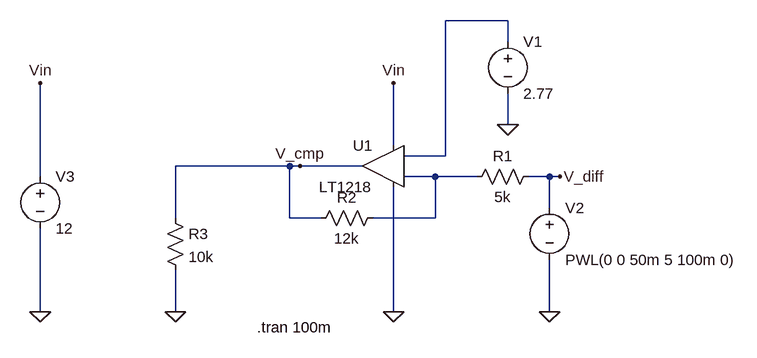
[diagram p0: schematic PositiveSchmitt.asc]
PositiveSchmitt.asc, the LTspice schematic file:
Version 4
SHEET 1 880 680
WIRE 256 -336 160 -336
WIRE 256 -304 256 -336
WIRE 256 -176 256 -224
WIRE 80 -144 80 -240
WIRE 160 -128 160 -336
WIRE 160 -128 96 -128
WIRE -80 -112 -256 -112
WIRE -64 -112 -80 -112
WIRE 32 -112 -64 -112
WIRE -464 -96 -464 -240
WIRE 144 -96 96 -96
WIRE 208 -96 144 -96
WIRE 320 -96 288 -96
WIRE 336 -96 320 -96
WIRE 320 -48 320 -96
WIRE -256 -32 -256 -112
WIRE -80 -32 -80 -112
WIRE -32 -32 -80 -32
WIRE 144 -32 144 -96
WIRE 144 -32 48 -32
WIRE -464 112 -464 -16
WIRE -256 112 -256 48
WIRE 80 112 80 -80
WIRE 320 112 320 32
FLAG 336 -96 V_diff
FLAG 256 -176 0
FLAG 80 112 0
FLAG 80 -240 Vin
FLAG -64 -112 V_cmp
FLAG 320 112 0
FLAG -256 112 0
FLAG -464 112 0
FLAG -464 -240 Vin
SYMBOL res 304 -112 R90
WINDOW 0 0 56 VBottom 2
WINDOW 3 32 56 VTop 2
SYMATTR InstName R1
SYMATTR Value 5k
SYMBOL res 64 -48 R90
WINDOW 0 0 56 VBottom 2
WINDOW 3 32 56 VTop 2
SYMATTR InstName R2
SYMATTR Value 12k
SYMBOL voltage 256 -320 R0
SYMATTR InstName V1
SYMATTR Value 2.77
SYMBOL voltage 320 -64 R0
WINDOW 123 0 0 Left 2
WINDOW 39 0 0 Left 2
SYMATTR InstName V2
SYMATTR Value PWL(0 0 50m 5 100m 0)
SYMBOL res -272 -48 R0
SYMATTR InstName R3
SYMATTR Value 10k
SYMBOL voltage -464 -112 R0
SYMATTR InstName V3
SYMATTR Value 12
SYMBOL Opamps\\LT1218 64 -112 M0
SYMATTR InstName U1
TEXT -130 136 Left 2 !.tran 100m

The netlist it stands for:
* PositiveSchmitt.asc
R1 V_diff N002 5k
R2 N002 V_cmp 12k
V1 N001 0 2.77
V2 V_diff 0 PWL(0 0 50m 5 100m 0)
R3 V_cmp 0 10k
V3 Vin 0 12
XU1 N002 N001 Vin 0 V_cmp NC_01 LT1218
.tran 100m
.lib LTC.lib
.backanno
.end